# EAGLE schematic panel (EAGLE 7.5.0)

## Sheet 1 of 4: MAIN
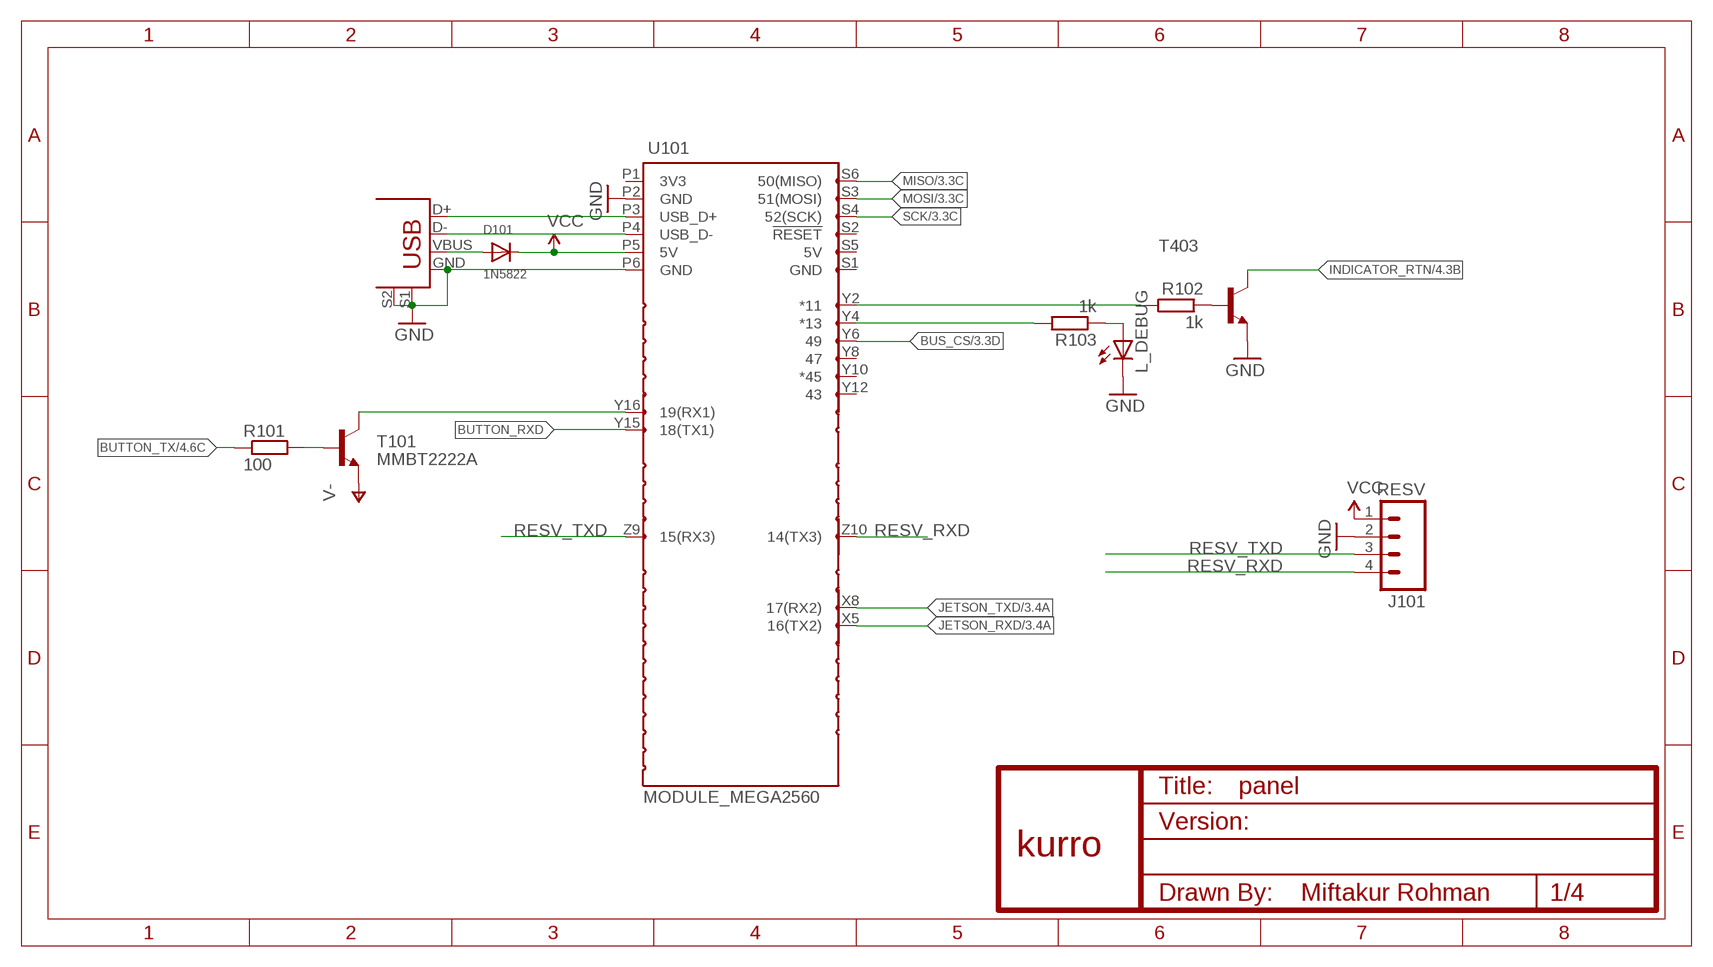
[diagram p0: schematic, sheet 1]

### Parts
D101  1N5822  DIODESMA  [SMADIODE]
J101  RESV  M04-XH-RA  [XH-4-RA]
L_DEBUG  LED5MM  [LED5MM]
R101  100  R-EU_R0603  [R0603]
R102  1k  R-EU_R0603  [R0603]
R103  1k  R-EU_R0603  [R0603]
T101  MMBT2222A  TRANSISTOR_NPNSOT23  [SOT23]
T403  MMBT2222ALT1-NPN-SOT23-BEC  [SOT23-BEC]
U101  MODULE_MEGA2560  MOD_MEGA_LAYOUT  [MOD_MEGA_LAYOUT]
U$1  KURRO_FOOTPRINT  [KURRO-LOGO]
U$2  USB+SHIELD  [USB-B-PTH]
U$3  MOD_MEGA_LAYOUT_SERIAL1  [MOD_MEGA_LAYOUT_SERIAL1]
U$4  MOD_MEGA_LAYOUT_SERIAL2  [MOD_MEGA_LAYOUT_SERIAL2]
U$5  MOD_MEGA_LAYOUT_SERIAL3  [MOD_MEGA_LAYOUT_SERIAL3]
U$6  MOD_MEGA_LAYOUT_ICSP  [MOD_MEGA_LAYOUT_ICSP]
U$7  MOD_MEGA_LAYOUT_Y_EVEN  [MOD_MEGA_LAYOUT_Y_EVEN]

### Nets
BUS_CS: U$7.Y6 ; also sheet 3
BUTTON_RXD: U$3.Y15(18(TX1))
BUTTON_TX: R101.1 ; also sheet 4
BUTTON_TXD: T101.3(C) U$3.Y16(19(RX1))
GND: J101.2 L_DEBUG.K(C) T403.E U101.P2(GND) U101.P6(GND) U$2.GND U$2.S1 U$2.S2 ; also sheet 2,3,4
INDICATOR_RTN: T403.C ; also sheet 4
JETSON_RXD: U$4.X5(16(TX2)) ; also sheet 3
JETSON_TXD: U$4.X8(17(RX2)) ; also sheet 3
MISO: U$6.S6(50(MISO)) ; also sheet 3
MOSI: U$6.S3(51(MOSI)) ; also sheet 3
N$1: R102.1 T403.B
N$4: U101.P3(USB_D+) U$2.D+
N$5: U101.P4(USB_D-) U$2.D-
N$6: D101.A U$2.VBUS
N$7: R102.2 U$7.Y2(*11)
N$8: R101.2 T101.1(B)
N$11: L_DEBUG.A R103.1
N$12: R103.2 U$7.Y4(*13)
RESV_RXD: J101.4 U$5.Z10(14(TX3))
RESV_TXD: J101.3 U$5.Z9(15(RX3))
SCK: U$6.S4(52(SCK)) ; also sheet 3
V- [power]: T101.2(E) ; also sheet 2,4
VCC: D101.C J101.1 U101.P5(5V) ; also sheet 2,3,4
Unconnected: U101.P1(3V3) U$6.S1(GND) U$6.S2(!RESET) U$6.S5(5V) U$7.Y8 U$7.Y10(*45) U$7.Y12

## Sheet 2 of 4: PSU
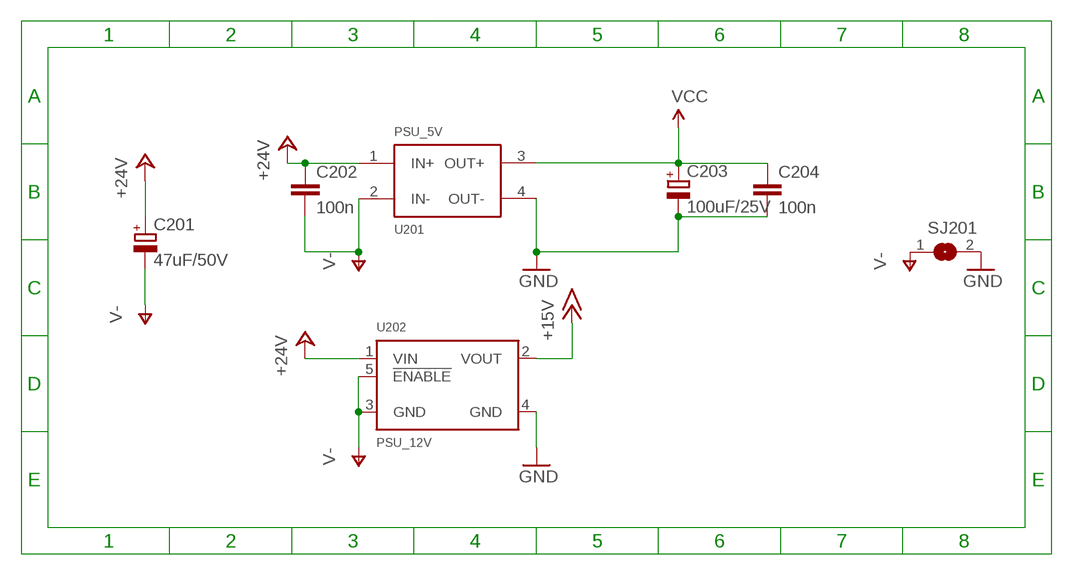
[diagram p1: schematic, sheet 2]

### Parts
C201  47uF/50V  CPOL-EUE2.5-7  [E2,5-7]
C202  100n  C-EUC0603  [C0603]
C203  100uF/25V  CPOL-EUE2.5-7  [E2,5-7]
C204  100n  C-EUC0603  [C0603]
SJ201  SJS  [SJS]
U201  PSU_5V  MP1584_MIN  [MP1584_MIN]
U202  PSU_12V  MOD_LM2596  [MOD_LM2596]

### Nets
+15V [power]: U202.2(VOUT) ; also sheet 4
+24V [power]: C201.+ C202.1 U201.1(IN+) U202.1(VIN) ; also sheet 4
GND: C203.- C204.2 SJ201.2 U201.4(OUT-) U202.4(GND) ; also sheet 1,3,4
V- [power]: C201.- C202.2 SJ201.1 U201.2(IN-) U202.3(GND) U202.5(!ENABLE) ; also sheet 1,4
VCC: C203.+ C204.1 U201.3(OUT+) ; also sheet 1,3,4

## Sheet 3 of 4: COMM
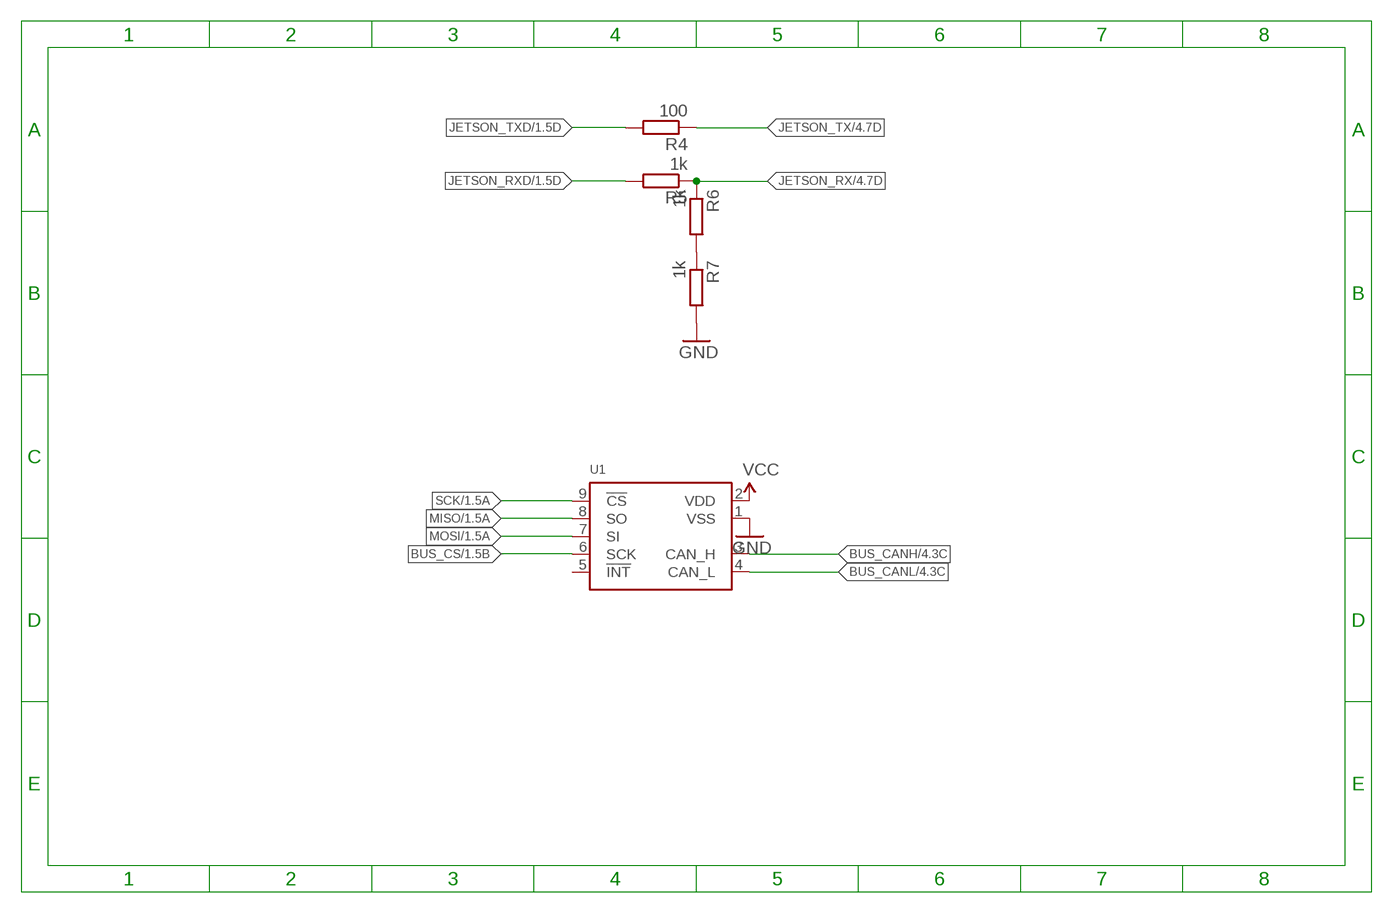
[diagram p2: schematic, sheet 3]

### Parts
R4  100  R-EU_R0603  [R0603]
R5  1k  R-EU_R0603  [R0603]
R6  1k  R-EU_R0603  [R0603]
R7  1k  R-EU_R0603  [R0603]
U1  MOD_MCP2515_NH  [MCP2515_CAN2]

### Nets
BUS_CANH: U1.3(CAN_H) ; also sheet 4
BUS_CANL: U1.4(CAN_L) ; also sheet 4
BUS_CS: U1.6(SCK) ; also sheet 1
GND: R7.2 U1.1(VSS) ; also sheet 1,2,4
JETSON_RX: R5.1 R6.1 ; also sheet 4
JETSON_RXD: R5.2 ; also sheet 1
JETSON_TX: R4.1 ; also sheet 4
JETSON_TXD: R4.2 ; also sheet 1
MISO: U1.8(SO) ; also sheet 1
MOSI: U1.7(SI) ; also sheet 1
N$14: R6.2 R7.1
SCK: U1.9(!CS) ; also sheet 1
VCC: U1.2(VDD) ; also sheet 1,2,4
Unconnected: U1.5(!INT)

## Sheet 4 of 4: CONNECTOR
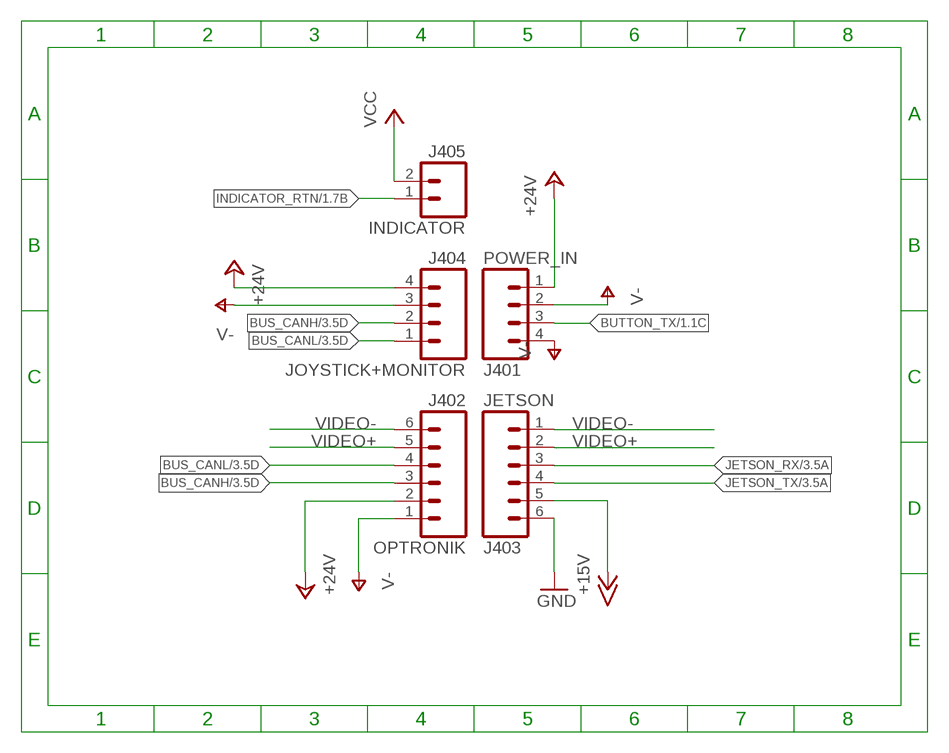
[diagram p3: schematic, sheet 4]

### Parts
J401  POWER_IN  M04-XH-RA  [XH-4-RA]
J402  OPTRONIK  M06-XH-RA  [XH-6-RA]
J403  JETSON  M06-XH-RA  [XH-6-RA]
J404  JOYSTICK+MONITOR  M04-XH-RA  [XH-4-RA]
J405  INDICATOR  M02-XH-RA  [XH-2-RA]

### Nets
+15V [power]: J403.5 ; also sheet 2
+24V [power]: J401.1 J402.2 J404.4 ; also sheet 2
BUS_CANH: J402.3 J404.2 ; also sheet 3
BUS_CANL: J402.4 J404.1 ; also sheet 3
BUTTON_TX: J401.3 ; also sheet 1
GND: J403.6 ; also sheet 1,2,3
INDICATOR_RTN: J405.1 ; also sheet 1
JETSON_RX: J403.3 ; also sheet 3
JETSON_TX: J403.4 ; also sheet 3
V- [power]: J401.2 J401.4 J402.1 J404.3 ; also sheet 1,2
VCC: J405.2 ; also sheet 1,2,3
VIDEO+: J402.5 J403.2
VIDEO-: J402.6 J403.1

## Library data of the parts
C201 C203 = rcl:CPOL-EU: POLARIZED CAPACITOR, European symbol
C202 C204 = rcl:C-EU: CAPACITOR, European symbol
D101 = adafruit:DIODE: Diode SMADIODE - SMA Surface Mount Package 20V 1A Schottky Diode Digikey: 641-1014-6-ND DO-1N4148 - Through Hole Small Current Diode SOD-123 20V 1 A (.5mV Vf) Schottky Diode - Digikey: MBRX120TPMSCT-ND SOD-323 10V 570mA (.38mV Vf, 3ns) Schottky Diode - Digikey: ZLLS410CT-ND SOD-523 30V 30mA Schottky Diode (RB751S-40TE61) - Digikey: RB751S-40TE61CT-ND SOT23-R/W - SOT23 Package (R = Solder Paste/Reflow Ovens, W = Hand-Soldering) BAT54Film 40V 300mA - Digikey: 497-7162-1-ND
J101 J401 J404 = SparkFun-Connectors:M04: Header 4 Standard 4-pin 0.1" header. Use with straight break away headers (SKU : PRT-00116), right angle break away headers (PRT-00553), swiss pins (PRT-00743), machine pins (PRT-00117), and female headers (PRT-00115). Molex polarized connector foot print use with SKU : PRT-08231 with associated crimp pins and housings. 1MM SMD Version SKU: PRT-10208
J402 J403 = SparkFun-Connectors:M06: Header 6 Standard 6-pin 0.1" header. Use with straight break away headers (SKU : PRT-00116), right angle break away headers (PRT-00553), swiss pins (PRT-00743), machine pins (PRT-00117), and female headers (PRT-00115). Molex polarized connector foot print use with SKU : PRT-08094 with associated crimp pins and housings. NOTES ON THE VARIANTS LOCK and LOCK_LONGPADS... This footprint was designed to help hold the alignment of a through-hole component (i.e. 6-pin header) while soldering it into place. You may notice that each hole has been shifted either up or down by 0.005 of an inch from it's more standard position (which is a perfectly straight line). This slight alteration caused the pins (the squares in the middle) to touch the edges of the holes. Because they are alternating, it causes a "brace" to hold the component in place. 0.005 has proven to be the perfect amount of "off-center" position when using our standard breakaway headers. Although looks a little odd when you look at the bare footprint, once you have a header in there, the alteration is very hard to notice. Also,if you push a header all the way into place, it is covered up entirely on the bottom side. This idea of altering the position of holes to aid alignment will be further integrated into the Sparkfun Library for other footprints. It can help hold any component with 3 or more connection pins.
J405 = SparkFun-Connectors:M02: Standard 2-pin 0.1" header. Use with - straight break away headers ( PRT-00116) - right angle break away headers (PRT-00553) - swiss pins (PRT-00743) - machine pins (PRT-00117) - female headers (PRT-00115) Molex polarized connector foot print use with: PRT-08233 with associated crimp pins and housings. 2.54_SCREWTERM for use with PRT-10571. 3.5mm Screw Terminal footprints for PRT-08084 5mm Screw Terminal footprints for use with PRT-08433
L_DEBUG = adafruit:LED: LED OSRAM: - CHIPLED LG R971, LG N971, LY N971, LG Q971, LY Q971, LO R971, LY R971 LH N974, LH R974 LS Q976, LO Q976, LY Q976 LO Q996 - Hyper CHIPLED LW Q18S LB Q993, LB Q99A, LB R99A - SideLED LS A670, LO A670, LY A670, LG A670, LP A670 LB A673, LV A673, LT A673, LW A673 LH A674 LY A675 LS A676, LA A676, LO A676, LY A676, LW A676 LS A679, LY A679, LG A679 - Hyper Micro SIDELED® LS Y876, LA Y876, LO Y876, LY Y876 LT Y87S - SmartLED LW L88C, LW L88S LB L89C, LB L89S, LG L890 LS L89K, LO L89K, LY L89K LS L896, LA L896, LO L896, LY L896 - TOPLED LS T670, LO T670, LY T670, LG T670, LP T670 LSG T670, LSP T670, LSY T670, LOP T670, LYG T670 LG T671, LOG T671, LSG T671 LB T673, LV T673, LT T673, LW T673 LH T674 LS T676, LA T676, LO T676, LY T676, LB T676, LH T676, LSB T676, LW T676 LB T67C, LV T67C, LT T67C, LS T67K, LO T67K, LY T67K, LW E67C LS E67B, LA E67B, LO E67B, LY E67B, LB E67C, LV E67C, LT E67C LW T67C LS T679, LY T679, LG T679 LS T770, LO T770, LY T770, LG T770, LP T770 LB T773, LV T773, LT T773, LW T773 LH T774 LS E675, LA E675, LY E675, LS T675 LS T776, LA T776, LO T776, LY T776, LB T776 LHGB T686 LT T68C, LB T68C - Hyper Mini TOPLED® LB M676 - Mini TOPLED Santana® LG M470 LS M47K, LO M47K, LY M47K Source: http://www.osram.convergy.de/
R4-R7 R101 = rcl:R-EU_: RESISTOR, European symbol
R102 R103 = resistor:R-EU_: RESISTOR, European symbol
SJ201 = jumper:SJ: SMD solder JUMPER
T101 = SparkFun-DiscreteSemi:TRANSISTOR_NPN: Generic NPN BJT MMBT2222A - TRANS-08049 (SOT-23, 1A 40V) MPSA42 - TRANS-09116 (SOT-23, 500mA 300V) MMBT5088LT1G - TRANS-11160 (SOT-23, 50 mA 30V)
T403 = transistor:*-NPN-: NPN Transistror BF959 corrected 2008.03.06
U1 = scorpion:MOD_MCP2515
U101 = encPhone:MOD_MEGA_LAYOUT
U201 = SparkFun-Boards:MP1584
U202 = scorpion:MOD_LM2596
U$1 = SparkFun:KURRO_FOOTPRINT
U$2 = SparkFun:USB+SHIELD: USB+Shield USB connector with shield pins connectable
U$3 = encPhone:MOD_MEGA_LAYOUT_SERIAL1
U$4 = encPhone:MOD_MEGA_LAYOUT_SERIAL2
U$5 = encPhone:MOD_MEGA_LAYOUT_SERIAL3
U$6 = encPhone:MOD_MEGA_LAYOUT_ICSP
U$7 = encPhone:MOD_MEGA_LAYOUT_Y_EVEN

## Net classes
0 default: width 0.406 mm, drill 0.59 mm, clearance 0.305 mm
2 power: width 0.61 mm, drill 0.8 mm, clearance 0.406 mm